# EAGLE design controller10 (EAGLE 8.2.1)

## Sheet 1 of 2
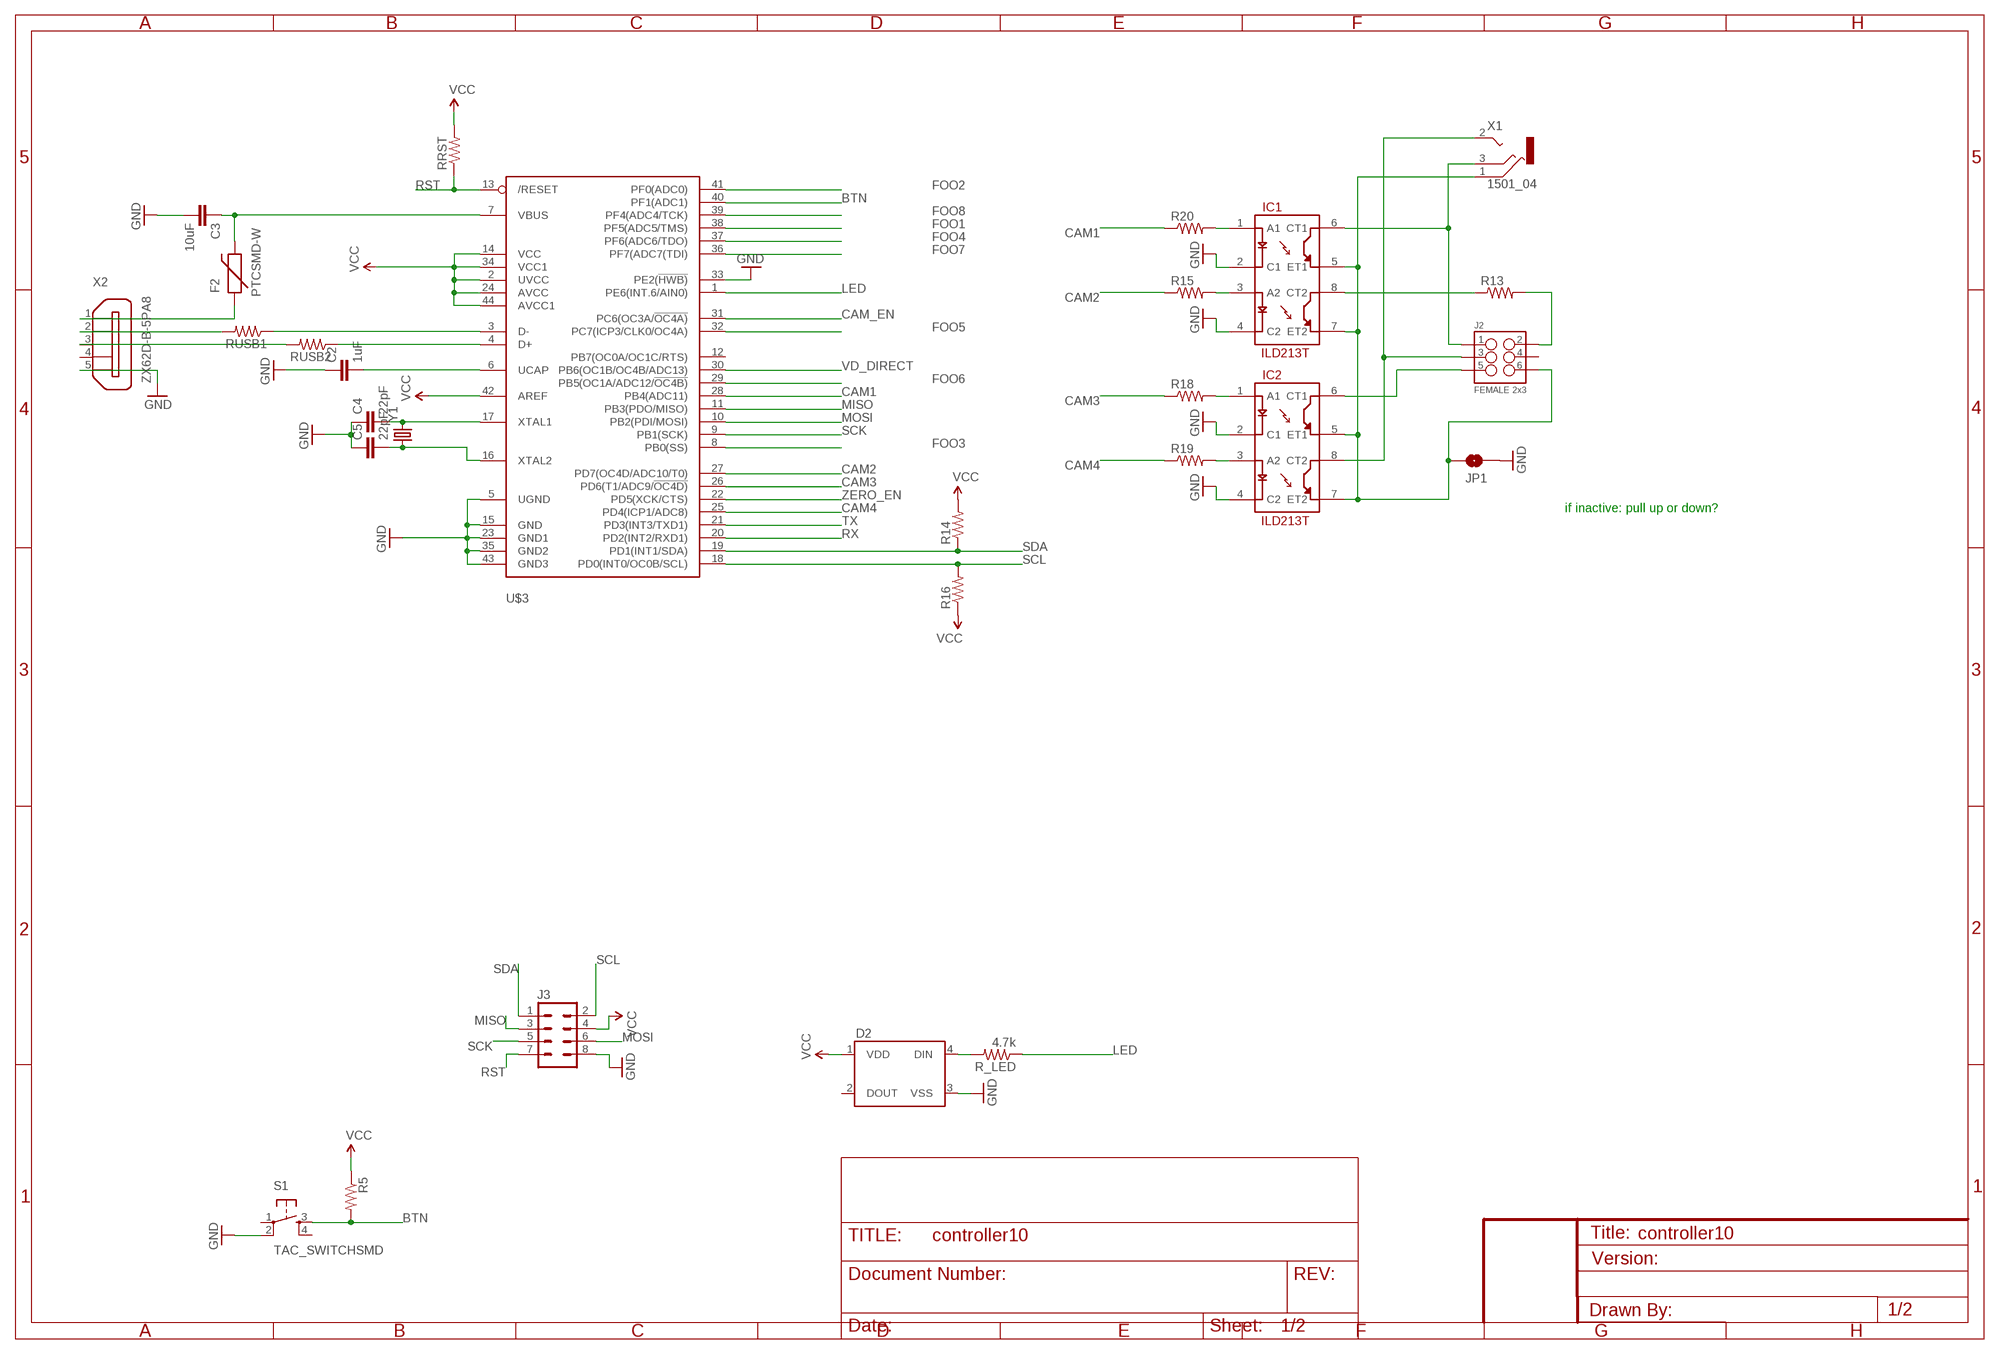
[diagram p0: schematic, sheet 1]

### Parts
C2  1uF  CAP1206  [1206]
C3  10uF  CAP1206  [1206]
C4  22pF  CAP0805  [0805]
C5  22pF  CAP0805  [0805]
D2  WS2812B  [WS2812B]
F2  PTCSMD-W  [PTC-1206-WIDE]
IC1  ILD213T  [SO08]
IC2  ILD213T  [SO08]
J2  FEMALE 2x3  M03X2FEMALE  [2X3]
J3  M04X2  [2X4]
JP1  JUMPER-PAD-2-NOYES_SILK  [PAD-JUMPER-2-NO_YES_SILK]
R5  RESISTOR1206  [1206]
R13  RESISTOR0805-RES  [0805]
R14  RESISTOR0805-RES  [0805]
R15  RESISTOR0805-RES  [0805]
R16  RESISTOR0805-RES  [0805]
R18  RESISTOR0805-RES  [0805]
R19  RESISTOR0805-RES  [0805]
R20  RESISTOR0805-RES  [0805]
R_LED  4.7k  RESISTOR1206  [1206]
RRST  RESISTOR1206  [1206]
RUSB1  RESISTOR1206  [1206]
RUSB2  RESISTOR1206  [1206]
S1  TAC_SWITCHSMD  TAC_SWITCHPTH  [TACTILE-PTH]
U$3  ATMEGA32U4-AU  [TQFP44]
X1  1501_04  [1501_05]
X2  ZX62D-B-5PA8  [ZX62D-B-5PA8]
Y1  CRYSTALCRYSTAL-SMD-5X3-16MHZ  [CRYSTAL-SMD-5X3]

### Nets
BTN: R5.2 S1.3 U$3.40(PF1(ADC1))
CAM1: R20.1 U$3.28(PB4(ADC11))
CAM2: R15.1 U$3.27(PD7(OC4D/ADC10/T0))
CAM3: R18.1 U$3.26(PD6(T1/ADC9/!OC4D))
CAM4: R19.1 U$3.25(PD4(ICP1/ADC8))
CAM_EN: U$3.31(PC6(OC3A/!OC4A)) ; also sheet 2
FOO1: U$3.38(PF5(ADC5/TMS))
FOO2: U$3.41(PF0(ADC0))
FOO3: U$3.8(PB0(SS))
FOO4: U$3.37(PF6(ADC6/TDO))
FOO5: U$3.32(PC7(ICP3/CLK0/OC4A))
FOO6: U$3.29(PB5(OC1A/ADC12/!OC4B))
FOO7: U$3.36(PF7(ADC7(TDI))
FOO8: U$3.39(PF4(ADC4/TCK))
GND: C2.1 C3.2 C4.1 C5.1 D2.3(VSS) IC1.2(C1) IC1.4(C2) IC2.2(C1) IC2.4(C2) J3.8 JP1.1 S1.2 U$3.5(UGND) U$3.15(GND) U$3.23(GND1) U$3.33(PE2(!HWB)) U$3.35(GND2) U$3.43(GND3) X2.5 ; also sheet 2
LED: R_LED.1 U$3.1(PE6(INT.6/AIN0))
MISO: J3.3 U$3.11(PB3(PDO/MISO))
MOSI: J3.6 U$3.10(PB2(PDI/MOSI))
N$4: RUSB1.1 U$3.3(D-)
N$5: RUSB2.1 U$3.4(D+)
N$7: D2.4(DIN) R_LED.2
N$8: C4.2 U$3.17(XTAL1) Y1.3
N$9: C5.2 U$3.16(XTAL2) Y1.1
N$10: RUSB1.2 X2.2
N$11: RUSB2.2 X2.3
N$12: IC2.1(A1) R18.2
N$13: IC2.3(A2) R19.2
N$15: IC1.3(A2) R15.2
N$16: J2.2 R13.2
N$18: IC1.8(CT2) R13.1
N$19: IC1.1(A1) R20.2
N$20: C2.2 U$3.6(UCAP)
N$22: C3.1 F2.2 U$3.7(VBUS)
N$31: IC1.6(CT1) J2.1 X1.3
N$32: IC2.8(CT2) J2.3 X1.2
N$33: IC2.6(CT1) J2.5
N$34: IC1.5(ET1) IC1.7(ET2) IC2.5(ET1) IC2.7(ET2) J2.6 JP1.2 X1.1
N$38: F2.1 X2.1
RST: J3.7 RRST.1 U$3.13(/RESET)
RX: U$3.20(PD2(INT2/RXD1)) ; also sheet 2
SCK: J3.5 U$3.9(PB1(SCK))
SCL: J3.2 R16.2 U$3.18(PD0(INT0/OC0B/SCL))
SDA: J3.1 R14.1 U$3.19(PD1(INT1/SDA))
TX: U$3.21(PD3(INT3/TXD1)) ; also sheet 2
VCC [power]: D2.1(VDD) J3.4 R5.1 R14.2 R16.1 RRST.2 U$3.2(UVCC) U$3.14(VCC) U$3.24(AVCC) U$3.34(VCC1) U$3.42(AREF) U$3.44(AVCC1) ; also sheet 2
VD_DIRECT: U$3.30(PB6(OC1B/OC4B/ADC13)) ; also sheet 2
ZERO_EN: U$3.22(PD5(XCK/CTS)) ; also sheet 2
Unconnected: D2.2(DOUT) J2.4 S1.1 S1.4 U$3.12(PB7(OC0A/OC1C/RTS)) X2.4 X2.S1 X2.S2 X2.S3 X2.S4

### Notes on the sheet
- if inactive: pull up or down?

## Sheet 2 of 2
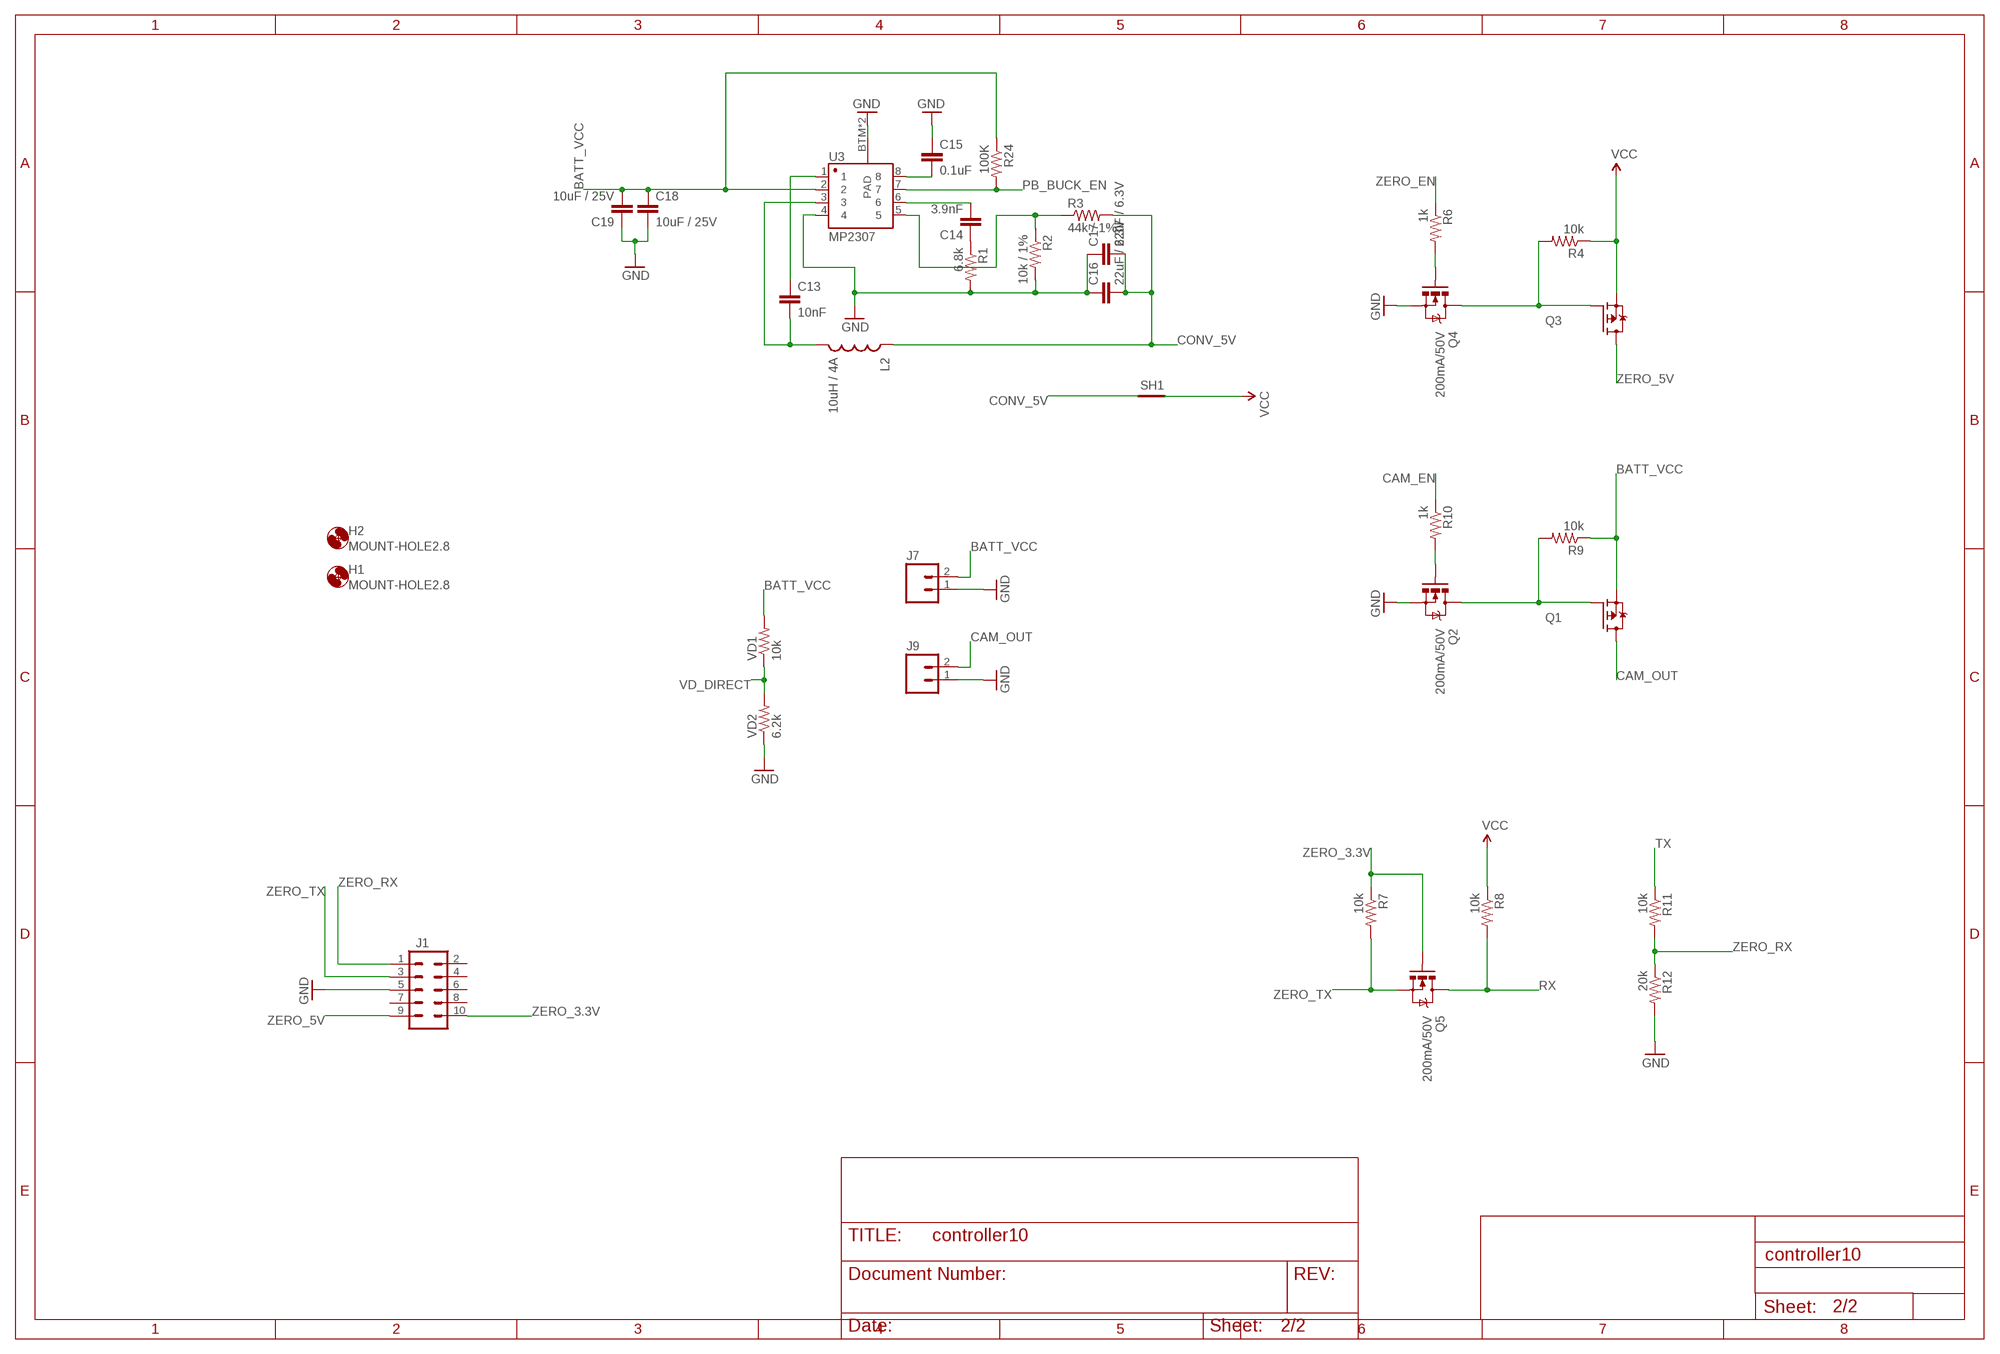
[diagram p1: schematic, sheet 2]

### Parts
C13  10nF  CAP1206  [1206]
C14  3.9nF  CAP0805  [0805]
C15  0.1uF  CAP0805  [0805]
C16  22uF / 6.3V  CAP1210  [1210]
C17  22uF / 6.3V  CAP1210  [1210]
C18  10uF / 25V  CAP1210  [1210]
C19  10uF / 25V  CAP1210  [1210]
H1  MOUNT-HOLE2.8  [2,8]
H2  MOUNT-HOLE2.8  [2,8]
J1  M05X2PTH  [AVR_ICSP]
J7  M02LOCK  [1X02_LOCK]
J9  M02LOCK  [1X02_LOCK]
L2  10uH / 4A  INDUCTORSRU1038  [SRU1038]
Q1  FDD4141TO252  [TO252]
Q2  200mA/50V  MOSFET-NCHANNELBSS138  [SOT23-3]
Q3  FDD4141TO252  [TO252]
Q4  200mA/50V  MOSFET-NCHANNELBSS138  [SOT23-3]
Q5  200mA/50V  MOSFET-NCHANNELBSS138  [SOT23-3]
R1  6.8k  RESISTOR0805-RES  [0805]
R2  10k / 1%  RESISTOR0805-RES  [0805]
R3  44k / 1%  RESISTOR0805-RES  [0805]
R4  10k  RESISTOR0805-RES  [0805]
R6  1k  RESISTOR0805-RES  [0805]
R7  10k  RESISTOR0805-RES  [0805]
R8  10k  RESISTOR0805-RES  [0805]
R9  10k  RESISTOR0805-RES  [0805]
R10  1k  RESISTOR0805-RES  [0805]
R11  10k  RESISTOR0805-RES  [0805]
R12  20k  RESISTOR0805-RES  [0805]
R24  100K  RESISTOR0805-RES  [0805]
SH1  SHORT-HT5  [SHORT_TOP-50]
U3  MP2307  GENERIC-SOIC8MSGEQ7N-FILTER  [SO08]
VD1  10k  RESISTOR1206  [1206]
VD2  6.2k  RESISTOR1206  [1206]

### Nets
BATT_VCC [camera_power]: C18.1 C19.2 J7.2 Q1.2(S) R9.1 R24.1 U3.2 VD1.2
CAM_EN: R10.1 ; also sheet 1
CAM_OUT [camera_power]: J9.2 Q1.3(D)
CONV_5V [power]: C16.2 C17.2 L2.1 R3.2 SH1.1
GND: C15.1 C16.1 C17.1 C18.2 C19.1 J1.5 J7.1 J9.1 Q2.2(S) Q4.2(S) R1.2 R2.2 R12.2 U3.4 U3.BTM(PAD) U3.P$1(PAD) VD2.1 ; also sheet 1
N$1: Q1.1(G) Q2.3(D) R9.2
N$2: Q4.1(G) R6.2
N$3: Q3.1(G) Q4.3(D) R4.2
N$6: Q2.1(G) R10.2
N$25: C15.2 U3.8
N$26 [power]: C13.2 L2.2 U3.3
N$27: C13.1 U3.1
N$28: C14.1 R1.1
N$29: C14.2 U3.6
N$30: R2.1 R3.1 U3.5
PB_BUCK_EN: R24.2 U3.7
RX: Q5.3(D) R8.2 ; also sheet 1
TX: R11.1 ; also sheet 1
VCC [power]: Q3.2(S) R4.1 R8.1 SH1.2 ; also sheet 1
VD_DIRECT: VD1.1 VD2.2 ; also sheet 1
ZERO_3.3V: J1.10 Q5.1(G) R7.1
ZERO_5V [power]: J1.9 Q3.3(D)
ZERO_EN: R6.1 ; also sheet 1
ZERO_RX: J1.1 R11.2 R12.1
ZERO_TX: J1.3 Q5.2(S) R7.2
Unconnected: J1.2 J1.4 J1.6 J1.7 J1.8

## Library data of the parts
C2 C13-C19 = SparkFun-Capacitors:CAP: Capacitor Standard 0603 ceramic capacitor, and 0.1" leaded capacitor.
C3-C5 = SparkFun-Passives:CAP: Capacitor Standard 0603 ceramic capacitor, and 0.1" leaded capacitor.
D2 = SparkFun-LED:WS2812B: WS2812B - Intelligent control LED integrated light source Technical Specifications: Power Supply Voltage (VDD): 3.5 to 5.3 V Input Voltage (VI): -0.5 to VDD+0.5 V Operating Junction Temperature (Topt): -25°C to +80°C Storage Temperature Range (Tstg): -55°C to +150°C; PROD_ID: DIO-12503
F2 = SparkFun-PowerIC:PTC: Resettable Fuse PTC Resettable Fuse. Spark Fun Electronics SKU : COM-08357
H1 H2 = holes:MOUNT-HOLE: MOUNTING HOLE with drill center marker
IC1 IC2 = SparkFun-DiscreteSemi:ILD213T: Dual optoisolator.
J1 = SparkFun-Connectors:M05X2: Header 5x2 Standard 10-pin dual row 0.1" header. Commonly used with AVR-ISP. Use with Spark Fun Electronics SKU: PRT-00778
J2 = SparkFun-Connectors:M03X2: 2x3 .1" header. Shrouded, with keying- CONN-10681 SMT- CONN-11415 Pogo pins- HW-11044; PROD_ID: CONN-11566
J3 = SparkFun-Connectors:M04X2: .1" header, two rows of four.
J7 J9 = SparkFun-Connectors:M02: Standard 2-pin 0.1" header. Use with - straight break away headers ( PRT-00116) - right angle break away headers (PRT-00553) - swiss pins (PRT-00743) - machine pins (PRT-00117) - female headers (PRT-00115) Molex polarized connector foot print use with: PRT-08233 with associated crimp pins and housings. 2.54_SCREWTERM for use with PRT-10571. 3.5mm Screw Terminal footprints for PRT-08084 5mm Screw Terminal footprints for use with PRT-08432
JP1 = SparkFun-Passives:JUMPER-PAD-2-NO
L2 = SparkFun-Passives:INDUCTOR: Inductors Basic Inductor/Choke - 0603 and 1206. Footprints are not proven and vary greatly between part numbers. INDUCTOR POWER 3.3UH 4.0A SMD 0.197" L x 0.197" W x 0.177" H (5.00mm x 5.00mm x 4.50mm)
Q1 Q3 = transistor-fet:FDD4141: P-Channel PowerTrench® MOSFET Source: FDD4141.pdf
Q2 Q4 Q5 = SparkFun-DiscreteSemi:MOSFET-NCHANNEL: Common NMOSFET Parts MFG P/N Store ID Prod ID FDD8780 TRANS-09984 SI7820DN TRANS-11055 FDS6630A IC-08089 2N7002PW TRANS-11151 FQP30N06L COM-10213 TRANS-10060 BSS123LT1G TRANS-08345 BSS138 TRANS-00830 BS170 2N7000; PROD_ID: TRANS-00830
R1-R4 R6-R12 R24 R_LED = SparkFun-Resistors:RESISTOR: Resistor Basic schematic elements and footprints for 0603, 1206, and PTH resistors.
R5 R13-R16 R18-R20 RRST RUSB1 RUSB2 VD1 VD2 = SparkFun-Passives:RESISTOR: Resistor Basic schematic elements and footprints for 0603, 1206, and PTH resistors.
S1 = SparkFun-Retired:TAC_SWITCH: Momentary Switch Button commonly used for reset or general input. Spark Fun Electronics SKU : COM-00097 SMT- SWCH-08247
SH1 = shorts:SHORT-H: Short between two nets; BOM: no
U3 = SparkFun-AnalogIC:GENERIC-SOIC8: A placeholder for generic narrow & wide SOIC8 foorptints - used on the DIP adapter board.; PROD_ID: IC-10141
U$3 = adafruit:ATMEGA32U4: http://www.ladyada.net/library/eagle
X1 = con-lumberg:1501_0*: Jack connectors according to JISC 6560, 2.5 mm Klinkensteckverbinder nach JISC 6560, 2,5 mm Source: http://www.lumberg.com/Produkte/PDFs/1501_05.pdfedit 1501_03 http://www.lumberg.com/Produkte/PDFs/1501_06.pdf; OC_FARNELL: 1216977; OC_NEWARK: unknown
X2 = zx62d-b-5pa8-oshpark_10:ZX62D-B-5PA8: Micro USB Type B Connector - Standard, Shell Through Hole Source: http://www.hirose.co.jp/cataloge_hp/ed_ZX_20140804.pdf; MF: Hirose; MPN: ZX62D-B-5PA8; OC_FARNELL: 2300438; OC_NEWARK: 69W0712
Y1 = SparkFun-FreqCtrl:CRYSTAL: Various standard crystals. Proven footprints.; PROD_ID: XTAL-08218

## Net classes
0 default: width 0.254 mm, clearance 0.254 mm
1 power: width 0.457 mm, clearance 0.254 mm
2 camera_power: width 0.66 mm, clearance 0.254 mm
3 usbsignal: width 0.254 mm, clearance 0.203 mm

## Board
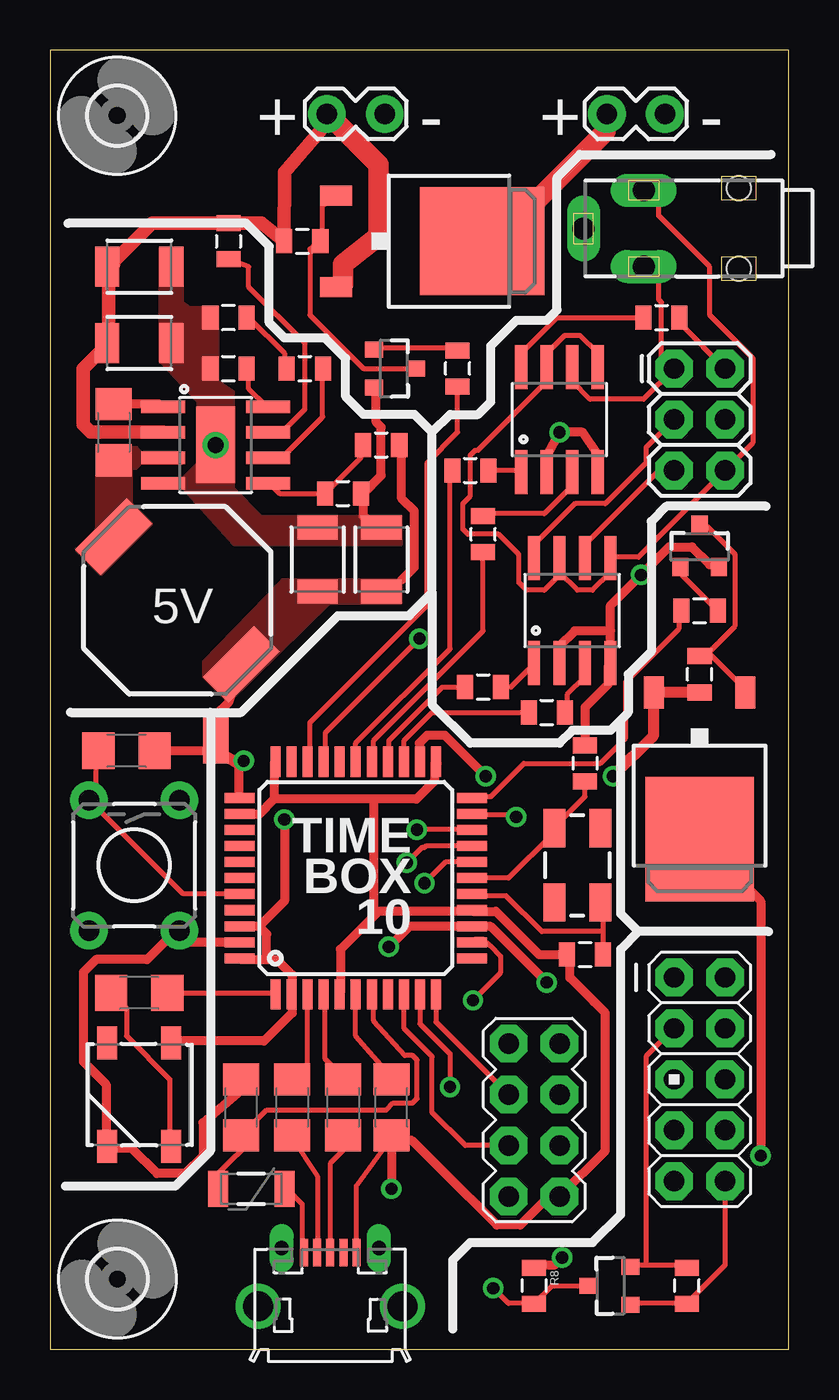
[diagram p2: board, top side]
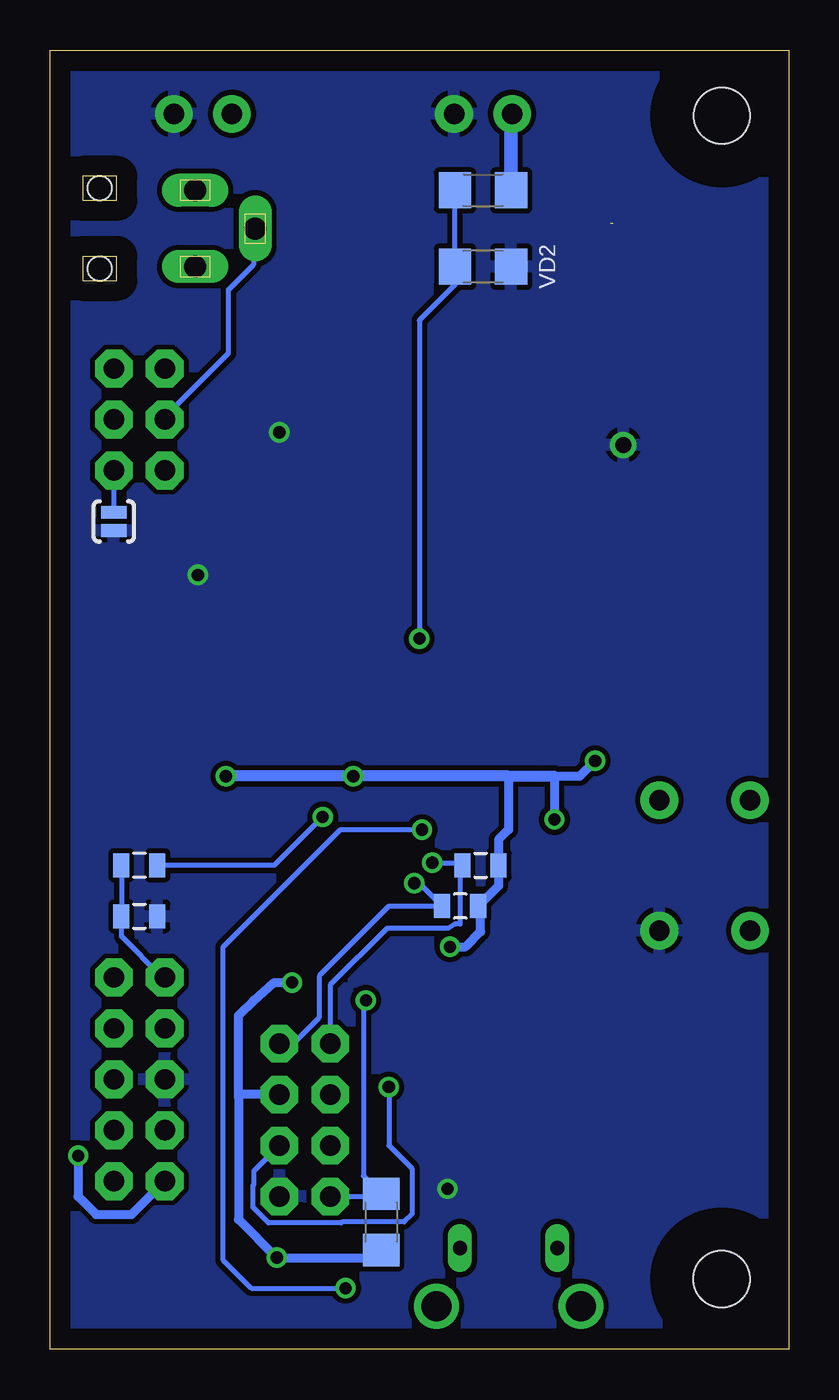
[diagram p3: board, bottom side, seen from below]

Size 36.83 x 64.77 mm. Coordinates in mm from the lower left corner, seen from the top.
Outline: 0,0 36.83,0 36.83,64.77 0,64.77 0,0
Copper layers (1*16): Top 0.035mm / dielectric 1.5mm / Bottom 0.035mm
Design rules "default": minimum track width 10mil, minimum drill 24mil, track to track 8mil, track to pad 8mil, pad to pad 8mil, via to via 8mil, smd to smd 8mil, copper to edge 40mil, drill to drill 8mil, minimum pad ring 10mil, minimum via ring 8mil, stop-mask expansion 4mil, vias tented up to drill 0mil, thermal gap 10mil

### Footprints (pad centres in the part's own frame; a part is rotated, then mirrored left to right if it is on the bottom)
1206 = smd 1.6 x 1.8: 1 -1.4,0; 2 1.4,0
0805 = smd 0.8 x 1.2: 1 -0.9,0; 2 0.9,0
1210 = smd 1.2 x 2: 1 -1.6,0; 2 1.6,0
WS2812B = smd 1.651 x 1: 1 -2.577,1.6; 2 -2.577,-1.6; 3 2.577,-1.6; 4 2.577,1.6
PTC-1206-WIDE = smd 1 x 1.8: 1 -1.654,0; 2 1.654,0
2,8 = hole 2.8: 0,0
SO08 = smd 0.61 x 2.21: 1 -1.905,-2.616; 2 -0.635,-2.616; 3 0.635,-2.616; 4 1.905,-2.616; 5 1.905,2.616; 6 0.635,2.616; 7 -0.635,2.616; 8 -1.905,2.616
AVR_ICSP = drill 1.016 pad 1.88 octagon: 1 -1.27,5.08; 2 1.27,5.08; 3 -1.27,2.54; 4 1.27,2.54; 5 -1.27,0; 6 1.27,0; 7 -1.27,-2.54; 8 1.27,-2.54; 9 -1.27,-5.08; 10 1.27,-5.08
2X3 = drill 1.016 pad 1.88 octagon: 1 0,0; 2 0,2.54; 3 2.54,0; 4 2.54,2.54; 5 5.08,0; 6 5.08,2.54
2X4 = drill 1.016 pad 1.88 octagon: 1 -3.81,-1.27; 2 -3.81,1.27; 3 -1.27,-1.27; 4 -1.27,1.27; 5 1.27,-1.27; 6 1.27,1.27; 7 3.81,-1.27; 8 3.81,1.27
1X02_LOCK = drill 1.016 pad 1.88: 1 -0.178,0; 2 2.718,0
PAD-JUMPER-2-NO_YES_SILK = smd 0.635 x 1.27: 1 -0.45,0; 2 0.45,0
SRU1038 = smd 1.8 x 3.6: 1 -4.5,0; 2 4.5,0
TO252 = smd 1 x 1.6: 1 -2.28,-4.8; 2 2.28,-4.8 | smd 5.4 x 6.2: 3 0,2.5
SOT23-3 = smd 0.8 x 0.9: 1 -0.95,-1; 2 0.95,-1; 3 0,1.1
TACTILE-PTH = drill 1.016 pad 1.88: 1 -3.251,2.261; 2 3.251,2.261; 3 -3.251,-2.261; 4 3.251,-2.261
SHORT_TOP-50 = smd 1.27 x 1.27: 1 0.635,0; 2 -0.635,0
SO08' = smd 0.61 x 2.21: 1 -1.905,-2.616; 2 -0.635,-2.616; 3 0.635,-2.616; 4 1.905,-2.616; 5 1.905,2.616; 6 0.635,2.616; 7 -0.635,2.616; 8 -1.905,2.616 | smd 3.81 x 1.93: BTM 0,0 | drill 0.8: P$1 0,0
TQFP44 = smd 1.5 x 0.5: 1 -5.8,4; 2 -5.8,3.2; 3 -5.8,2.4; 4 -5.8,1.6; 5 -5.8,0.8; 6 -5.8,0; 7 -5.8,-0.8; 8 -5.8,-1.6; 9 -5.8,-2.4; 10 -5.8,-3.2; 11 -5.8,-4; 23 5.8,-4; 24 5.8,-3.2; 25 5.8,-2.4; 26 5.8,-1.6; 27 5.8,-0.8; 28 5.8,0; 29 5.8,0.8; 30 5.8,1.6; 31 5.8,2.4; 32 5.8,3.2; 33 5.8,4 | smd 0.5 x 1.5: 12 -4,-5.8; 13 -3.2,-5.8; 14 -2.4,-5.8; 15 -1.6,-5.8; 16 -0.8,-5.8; 17 0,-5.8; 18 0.8,-5.8; 19 1.6,-5.8; 20 2.4,-5.8; 21 3.2,-5.8; 22 4,-5.8; 34 4,5.8; 35 3.2,5.8; 36 2.4,5.8; 37 1.6,5.8; 38 0.8,5.8; 39 0,5.8; 40 -0.8,5.8; 41 -1.6,5.8; 42 -2.4,5.8; 43 -3.2,5.8; 44 -4,5.8
1501_05 = drill 1.1 pad 1.4 long: 1 -1.9,-8.5; 2 0,-11.5; 3 1.9,-8.5 | hole 1.2: -2,-3.75; 2,-3.75
ZX62D-B-5PA8 = smd 1.35 x 0.4: 1 4.825,1.3; 2 4.825,0.65; 3 4.825,0; 4 4.825,-0.65; 5 4.825,-1.3 | drill 1.5: S1 2.15,-3.6; S2 2.15,3.6 | drill 0.7 long: S3 5.05,2.425; S4 5.05,-2.425
CRYSTAL-SMD-5X3 = smd 1.9 x 1.1: 1 -1.85,-1.15; 2 1.85,-1.15; 3 1.85,1.15; 4 -1.85,1.15

### Placement (x,y rotation side)
C2  17.02,12.06 90 top
C3  9.53,12.06 90 top
C4  26.67,29.21 270 top
C5  26.67,19.68 0 top
C13  3.17,45.72 270 top
C14  12.7,48.9 0 top
C15  8.89,48.9 0 top
C16  16.51,39.37 270 top
C17  13.34,39.37 270 top
C18  4.45,53.98 0 top
C19  4.45,50.16 180 top
D2  4.45,12.7 270 top
F2  10.03,8 180 top
H1  3.35,3.51 0 top
H2  3.34,61.51 0 top
IC1  25.4,46.35 0 top
IC2  26.04,36.83 0 top
J1  32.38,13.46 0 top
J2  31.11,48.9 270 top
J3  24.13,11.43 270 top
J7  16.51,61.59 180 top
J9  30.48,61.59 180 top
JP1  33.66,41.27 90 bottom
L2  6.35,37.34 135 top
Q1  19.05,55.24 270 top
Q2  17.14,48.9 270 top
Q3  32.38,27.94 180 top
Q4  32.38,40.01 0 top
Q5  27.94,3.17 90 top
R1  8.89,51.44 180 top
R2  14.61,42.67 0 top
R3  16.51,45.09 0 top
R4  32.38,33.66 90 top
R5  3.81,29.84 180 top
R6  32.38,36.83 0 top
R7  31.75,3.17 90 top
R8  24.13,3.17 270 top
R9  12.57,55.24 0 top
R10  20.32,48.9 90 top
R11  32.38,24.13 180 bottom
R12  32.38,21.59 0 bottom
R13  30.48,51.44 0 top
R14  15.37,24.13 0 bottom
R15  21.59,40.64 90 top
R16  16.38,22.1 180 bottom
R18  21.59,33.02 0 top
R19  24.77,31.75 0 top
R20  20.95,43.81 0 top
R24  8.89,55.24 270 top
R_LED  4.45,17.78 180 top
RRST  20.32,6.35 270 bottom
RUSB1  12.06,12.06 270 top
RUSB2  14.61,12.06 270 top
S1  4.19,24.13 270 top
SH1  8.26,30.48 90 top
U3  MP2307  [SO08']  8.26,45.09 270 top
U$3  15.24,23.5 90 top
VD1  15.24,57.78 0 bottom
VD2  15.24,53.98 180 bottom
X1  38.1,55.88 270 top
X2  13.97,0 90 top
Y1  26.29,24.13 90 top

### Tracks (layer width: path | path; a pad name or v marks a point on that pad's centre or on a via)
BATT_VCC  (1 unrouted)
  Top 0.66: U3.2 2.03,45.72 1.65,46.1 1.65,48.9 2.67,49.91 C19.2 2.92,50.16 2.92,53.98 C18.1 3.17,54.1 3.05,54.1 5.08,56.13 7.11,56.13 R24.1 | 8.76,56.13 10.54,56.13 R9.1 11.68,58.67 14.03,61.4 | 14.61,53.09 Q1.2 | 13.84,61.59 J7.2
  Top 1.016: 14.61,53.09 14.61,54.1 16.38,55.5 16.38,59.05 14.03,61.4 13.84,61.59
  Bottom 0.66: VD1.2 13.84,61.59 J7.2
BTN
  Top 0.254: U$3.40 9.4,22.73 6.6,22.73 2.03,27.3 S1.3 2.03,27.43 2.29,27.69 2.29,29.84 R5.2
CAM1
  Top 0.254: U$3.28 15.24,30.23 19.94,34.92 19.94,43.81 R20.1
CAM2
  Top 0.254: R15.1 21.59,35.81 16.13,30.35 16.13,29.34 U$3.27
CAM3
  Top 0.254: R18.1 19.56,33.02 16.89,30.35 16.89,29.34 U$3.26
CAM4
  Top 0.254: R19.1 19.05,31.75 17.65,30.35 17.65,29.34 U$3.25
CAM_EN
  Top 0.254: R10.1 20.32,45.72 18.8,44.2 18.8,37.08 12.95,31.24 12.95,29.34 U$3.31
CAM_OUT
  Top 0.66: 27.69,61.59 J9.2 | 22.23,55.24 Q1.3
  Top 1.016: 27.69,61.59 27.69,60.71 22.23,55.24
CONV_5V
  Top 0.457: 17.53,38.35 18.16,38.99 18.16,41.78 17.53,42.42 17.53,45.09 R3.2 | SH1.1 8.26,31.62 8.89,32.26 L2.1
  pour Top (no thermals): 17.53,37.21 17.53,38.35 11.56,38.35 7.62,34.29 7.62,33.53 8.89,32.26 13.97,37.21
GND  (via drill 0.61)
  Top 0.254: X2.5 15.27,8.16 17.02,10.54
  Top 0.457: 11.18,27.43 10.41,26.67 9.53,26.67 U$3.35 | 11.18,27.43 11.18,29.21 U$3.33 | 16.38,21.84 14.48,19.94 14.48,17.78 U$3.5 | 16.38,21.84 20.83,21.84 U$3.15 21.08,21.84 22.23,21.84 24.38,19.68 C5.1 25.91,19.56 25.91,18.54 27.11,17.34 27.69,16.76 27.69,9.91 J3.8 24.87,7.62 23.45,6.2 22.27,6.2 19.56,8.91 18.03,10.41 17.02,10.54 C2.1 v17.02,8 | 16.38,21.84 16.13,21.84 16.13,27.43 | 19.3,29.21 U$3.23 19.17,29.23 19.17,28.34 18.26,27.43 16.13,27.43 | 16.13,27.43 11.18,27.43 | 27.94,35.81 IC2.4 27.81,34.04 27.81,33.15 26.67,32 C4.1 | 27.94,35.81 27.94,37.08 v29.46,38.61 30.86,40.01 32,40.01 32.89,39.12 33.27,39.12 Q4.2 | IC2.2 25.4,35.05 26.16,35.81 27.94,35.81 | C3.2 10.16,13.46 7.62,11.3 7.62,9.65 6.73,8.76 5.33,8.76 4.06,10.03 2.92,10.03 D2.3 2.79,10.29 2.79,13.21 1.65,14.35 1.65,18.8 2.29,19.43 4.83,19.43 6.22,20.83 S1.2 6.48,20.83 6.99,20.32 9.4,20.32 U$3.43 | IC1.2 24.77,44.58 v25.4,45.72 26.54,45.72 27.3,44.58 IC1.4 | Q2.2 16.26,47.88 16.26,46.23 16.51,45.97 16.51,43.56 15.62,42.67 R2.2 15.62,42.55 15.62,41.53 C16.1
  pour Bottom: 0,0 36.83,0 36.83,64.77 0,64.77
  pour Top (no thermals): 17.53,41.53 10.54,41.53 9.14,42.93 9.14,47.75 8.38,48.26 8.38,51.94 6.99,51.94 6.6,52.2 6.6,54.86 5.46,54.86 5.46,49.28 7.37,47.24 7.37,44.2 6.6,43.43 6.6,42.93 9.14,40.13 17.53,40.13
LED
  Top 0.254: R_LED.1 11.18,17.78 U$3.1
MISO
  Top 0.254: U$3.11 19.24,16.32 J3.3
MOSI  (via drill 0.61)
  Top 0.254: U$3.10 18.44,16.23 19.94,14.73 v19.94,13.08
  Bottom 0.254: v19.94,13.08 19.94,10.16 18.8,9.02 18.8,6.73 19.18,6.35 22.26,6.35 22.31,6.3 25.95,6.3 26.72,7.07 26.72,8.17 26.67,8.22 26.67,8.89 J3.6
N$1
  Top 0.254: Q2.3 15.62,48.9 12.95,51.56 12.95,54.86 13.59,55.37 | 13.59,55.37 13.59,57.02 14.22,57.53 Q1.1 | 13.59,55.37 R9.2
N$2
  Top 0.254: Q4.1 31.5,38.99 31.5,38.61 R6.2
N$3
  Top 0.254: Q4.3 32.38,41.02 32.77,41.02 34.16,39.62 34.16,36.07 32.77,34.67 32.38,34.67 R4.2 32.89,34.67 34.54,33.02 34.54,32.77 Q3.1
N$4
  Top 0.254: U$3.3 12.83,17.65 12.83,13.72 12.7,13.59 RUSB1.1
N$5
  Top 0.254: U$3.4 13.72,17.65 13.72,14.48 14.61,13.59 RUSB2.1
N$6
  Top 0.254: Q2.1 16.26,49.91 20.32,49.91 R10.2
N$7
  Top 0.254: D2.4 5.97,10.16 5.97,13.46 3.81,15.62 3.81,17.02 R_LED.2
N$8
  Top 0.254: C4.2 26.67,27.56 25.15,26.04 Y1.3 25.02,25.91 25.02,25.65 22.86,23.5 U$3.17
N$9
  Top 0.254: 27.56,20.83 27.56,22.23 Y1.1 | 27.56,20.83 C5.2 | 27.56,20.83 24.51,20.83 22.73,22.61 21.08,22.61 U$3.16
N$10
  Top 0.254: X2.2 13.34,4.83 13.34,8.64 12.06,10.54 RUSB1.2
N$11
  Top 0.254: X2.3 13.97,9.27 15.24,10.54 RUSB2.2
N$12
  Top 0.254: R18.2 22.99,33.02 24.13,34.16 IC2.1
N$13
  Top 0.254: IC2.3 26.67,33.53 25.78,32.64 25.78,31.75 R19.2
N$15
  Top 0.254: IC1.3 26.04,43.05 24.64,41.66 21.59,41.66 R15.2
N$16
  Top 0.254: J2.2 31.5,51.05 31.5,51.44 R13.2
N$18
  Top 0.254: R13.1 25.27,51.44 23.5,49.66 IC1.8
N$19
  Top 0.254: R20.2 23.5,43.81 IC1.1
N$20
  Top 0.254: U$3.6 15.24,15.62 17.02,13.59 C2.2
N$22
  Top 0.254: U$3.7 16.13,17.65 16.13,16.38 17.69,14.65 18.08,14.65 18.3,14.42 18.3,12.51 18.08,12.28 17.11,12.28 16.76,11.94 10.79,11.94 C3.1 10.16,10.54 8.38,8.76 F2.2
N$25
  Top 0.254: C15.2 9.91,48.9 9.91,47.88 10.79,46.99 U3.8
N$26
  pour Top (no thermals): 6.6,44.7 4.57,44.7 4.32,44.96 2.29,44.96 2.29,40.89 1.27,39.88 2.54,38.61 5.08,41.15 4.06,42.16 4.06,43.94 4.32,43.94 4.57,44.2 6.6,44.2
N$27
  Top 0.254: 5.46,47.12 5.59,46.99 U3.1 | C13.1
  Top 0.457: 5.46,47.12 C13.1
N$28
  Top 0.254: C14.1 11.68,48.9 11.68,49.66 9.91,51.44 R1.1
N$29
  Top 0.254: U3.6 11.56,44.45 13.59,46.48 C14.2
N$30
  Top 0.254: U3.5 10.92,43.18 11.43,42.67 R2.1 15.49,44.45 15.49,45.09 R3.1
N$31
  Top 0.254: IC1.6 26.04,48.26 26.92,47.37 29.59,47.37 J2.1 30.99,48.9 30.48,49.4 30.48,52.2 30.35,52.32 30.35,53.98 X1.3
N$32
  Top 0.254: IC2.8 24.13,40.13 26.16,42.16 27.69,42.16 29.72,44.2 29.72,44.96 J2.3
  Bottom 0.254: J2.3 31.11,46.48 27.94,49.66 27.94,52.83 26.67,54.1 26.67,55.24 X1.2
N$33
  Top 0.254: IC2.6 26.67,40.13 30.35,43.81 J2.5
N$34
  Top 0.254: IC1.5 27.3,49.66 26.42,50.55 25.65,50.55 24.77,49.66 IC1.7 24.77,48.26 21.34,44.83 21.21,44.83 20.95,44.58 20.95,42.55 20.57,42.16 20.57,40.89 20.83,40.64 22.35,40.64 23.37,39.62 23.37,38.23 23.75,37.85 24.64,37.85 25.4,38.61 IC2.7 25.4,38.73 26.29,37.85 27.05,37.85 27.94,38.73 IC2.5 27.94,39.5 29.34,39.5 J2.6 35.05,45.21 35.05,49.4 32.89,51.56 32.89,53.98 30.35,56.52 30.35,57.66 X1.1
  Bottom 0.254: J2.6 JP1.2
N$38
  Top 0.254: X2.1 12.57,4.83 12.57,7.24 11.81,8 F2.1
PB_BUCK_EN
  Top 0.254: U3.7 11.56,45.72 12.7,46.86 12.7,50.16 9.91,52.96 9.91,53.98 R24.2
RST  (via drill 0.61)
  Top 0.254: v21.08,17.4 22.48,18.8 22.48,19.59 21.95,20.13 21.91,20.13 21.59,20.45 21.19,20.45 U$3.13
  Bottom 0.254: J3.7 20.32,7.62 RRST.1 21.21,8.64 21.21,17.4 v21.08,17.4
RX  (via drill 0.61)
  Top 0.254: Q5.3 25.02,3.17 24.13,2.29 R8.2 24.12,2.29 22.86,2.29 v22.1,3.05 | U$3.20 21.03,25.91 v18.29,25.91
  Bottom 0.254: v22.1,3.05 26.8,3.05 28.19,4.45 28.19,20.07 22.35,25.91 v18.29,25.91
SCK
  Top 0.254: U$3.9 17.65,17.65 17.65,16 19.05,14.61 19.05,11.81 20.7,10.16 J3.5
SCL  (via drill 0.61)
  Top 0.254: U$3.18 19.72,24.3 v18.67,23.24
  Bottom 0.254: v18.67,23.24 18.43,23.24 R16.2 19.94,22.1 23.37,18.67 23.41,18.54 23.41,16.56 24.73,15.24 J3.2
SDA  (via drill 0.61)
  Top 0.254: U$3.19 18.73,25.09 18.66,25.02 18.54,25.02 v17.78,24.26
  Bottom 0.254: v17.78,24.26 16.39,24.26 R14.1 16.38,24.13 16.38,21.21 16.63,21.21 16.98,20.99 20.03,20.99 22.86,18.16 J3.1
TX  (via drill 0.61)
  Top 0.254: U$3.21 21.07,26.67 23.24,26.67 v23.24,26.54
  Bottom 0.254: v23.24,26.54 25.65,24.13 R11.1
VCC  (via drill 0.61)
  Top 0.457: 10.79,19.43 9.53,19.43 U$3.44 | 10.79,19.43 11.3,19.43 12.06,18.67 12.06,17.78 U$3.2 12.06,17.53 12.06,16.76 10.67,15.37 6.1,15.37 D2.1 | 10.41,21.08 9.53,21.08 U$3.42 | 10.41,21.08 10.79,20.7 10.79,19.43 | R5.1 SH1.2 | 9.4,29.21 9.4,27.56 U$3.34 | v25.53,4.57 25.15,4.19 24.13,4.19 R8.1 | R4.1 | 30.23,32.77 Q3.2 30.1,32.51 | v24.77,18.29 21.97,21.08 21.08,21.08 U$3.14 20.75,21.09 20.71,21.08 17.91,21.08 v16.89,20.07 16.76,19.94 | v21.72,28.57 19.68,30.61 18.8,30.61 18.41,30.23 18.41,29.34 U$3.24 | 10.41,21.08 11.68,22.35 v11.68,26.42
  Top 0.559: SH1.2 9.4,29.21 v9.65,29.34 | 30.23,32.77 R4.1 | 30.1,32.51 30.1,30.61 v28.07,28.57
  Bottom 0.457: 25.78,4.83 v25.53,4.57 | v11.68,26.42 11.68,28.57 10.41,28.57 v9.65,29.34 | 13.97,28.57 13.97,25.91 14.47,25.41 R14.2 14.47,23.11 R16.1 15.37,21.98 15.37,20.83 16.13,20.07 v16.89,20.07 | v25.53,4.57 27.43,6.48 27.43,12.57 | v25.53,4.57 20.7,4.57 RRST.2 | v24.77,18.29 25.65,18.29 26.67,17.4 27.43,16.64 27.43,12.57 | J3.4 27.3,12.7 27.43,12.57
  Bottom 0.559: v28.07,28.57 v21.72,28.57 13.97,28.57 11.68,28.57
VD_DIRECT  (via drill 0.61)
  Top 0.254: v18.41,35.43 13.72,30.73 13.72,29.34 U$3.30
  Bottom 0.254: v18.41,35.43 18.41,51.31 16.64,53.09 VD2.2 | VD2.2 VD1.1 | VD2.2
ZERO_3.3V
  Top 0.254: 31.75,2.29 28.96,2.29 Q5.1 | 31.75,2.29 33.66,4.19 J1.10 | 31.75,2.29 R7.1
ZERO_5V  (via drill 0.61)
  Top 0.457: v35.43,9.65 35.43,22.35 32.38,25.4 Q3.3
  Bottom 0.457: v35.43,9.65 35.43,7.62 34.54,6.73 32.77,6.73 J1.9
ZERO_EN
  Top 0.254: R6.1 31.37,36.83 31.37,35.94 28.7,33.27 28.7,30.48 27.43,29.21 23.62,29.21 21.97,27.56 21.08,27.56 U$3.22
ZERO_RX
  Bottom 0.254: R12.1 R11.2 | R12.1 33.27,20.57 31.24,18.54 J1.1 | R12.1
ZERO_TX
  Top 0.254: 29.72,4.19 31.75,4.19 R7.2 | 29.72,4.19 28.96,4.19 Q5.2 | 29.72,4.19 29.72,14.61 J1.3

### Text on the board
tPlace: + | - | + | - | 5V | TIME | BOX | 10